# Altium schematic sheet GenesysHat - System.SchDoc
size A
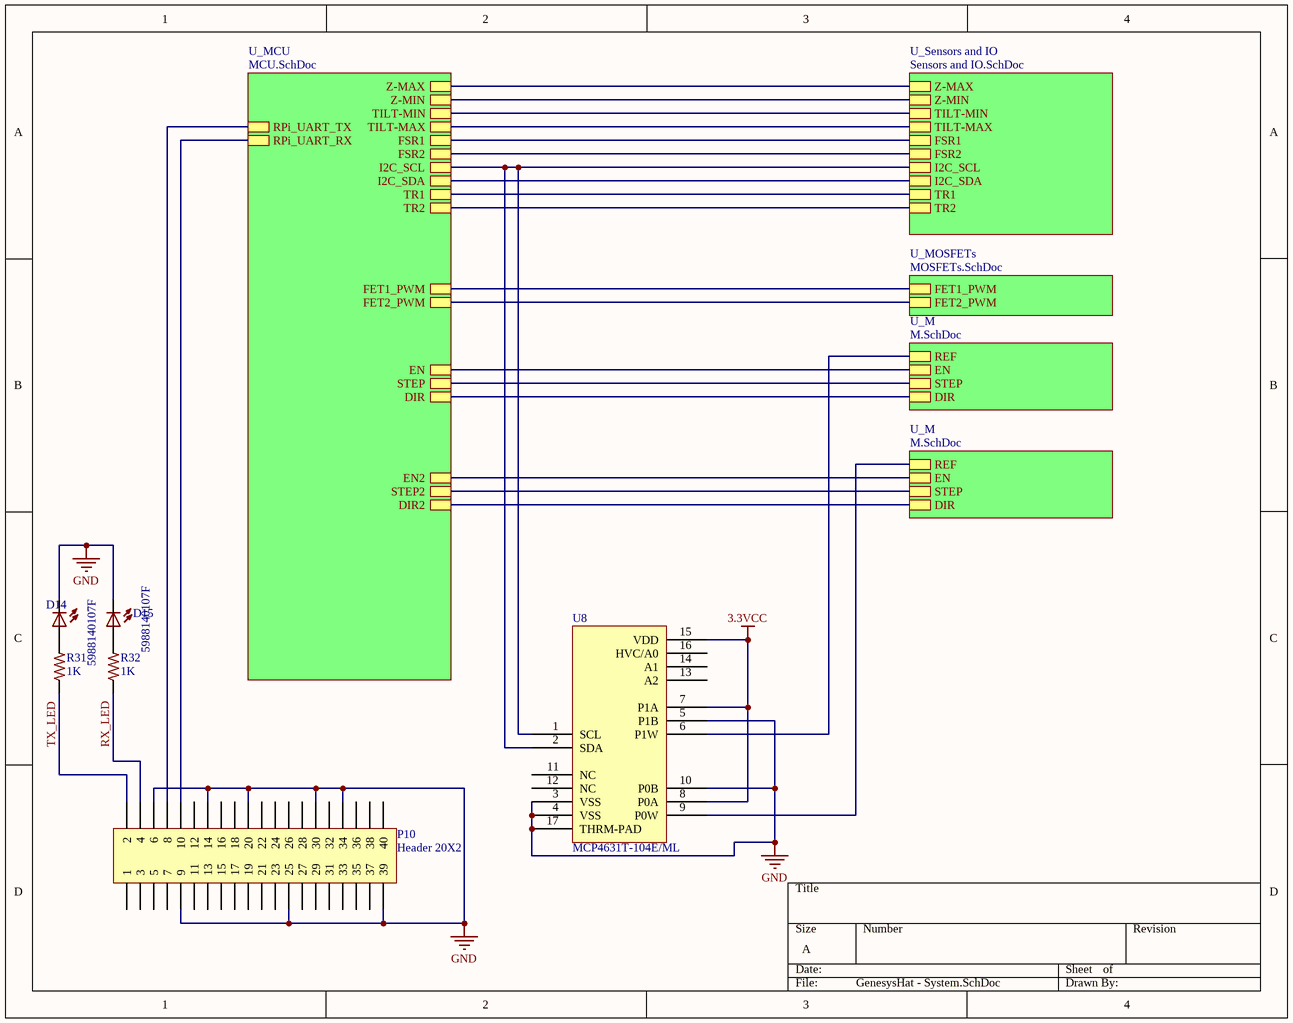
[diagram p0: GenesysHat - System.SchDoc]

## Parts
D14  5988140107F  [LED2012120]
D15  5988140107F  [LED2012120]
P10  Header 20X2  [HDR2X20]
R31  1K  [R0603]
R32  1K  [R0603]
U8  MCP4631T-104E/ML  [MCP4631T-104E/ML]

## Sub-sheets
U_M = M.SchDoc: REF, EN, STEP, DIR
U_M = M.SchDoc: REF, EN, STEP, DIR
U_MCU = MCU.SchDoc: FET1_PWM, FET2_PWM, Z-MAX, Z-MIN, TILT-MIN, TILT-MAX, FSR1, FSR2, I2C_SCL, I2C_SDA, TR1, TR2, EN, STEP, DIR, EN2, STEP2, DIR2, RPi_UART_TX, RPi_UART_RX
U_MOSFETs = MOSFETs.SchDoc: FET1_PWM, FET2_PWM
U_Sensors and IO = Sensors and IO.SchDoc: Z-MAX, Z-MIN, TILT-MIN, TILT-MAX, FSR1, FSR2, I2C_SCL, I2C_SDA, TR1, TR2

## Nets
3.3VCC: U8.7(P1A) U8.8(P0A) U8.15(VDD)
GND: D14.C D15.C P10.6 P10.9 P10.14 P10.20 P10.25 P10.30 P10.34 P10.39 U8.3(VSS) U8.4(VSS) U8.5(P1B) U8.10(P0B) U8.17(THRM-PAD)
RX_LED: P10.4 R32.1
TX_LED: P10.2 R31.1
NetD14_A: D14.A R31.2
NetD15_A: D15.A R32.2
NetP10_8: P10.8 ; sheet U_MCU/RPi_UART_TX
NetP10_10: P10.10 ; sheet U_MCU/RPi_UART_RX
NetU8_1: U8.1(SCL) U8.2(SDA) ; sheet U_Sensors and IO/I2C_SCL, sheet U_MCU/I2C_SCL
NetU8_6: U8.6(P1W) ; sheet U_M/REF
NetU8_9: U8.9(P0W) ; sheet U_M/REF
(unnamed): sheet U_M/EN, sheet U_MCU/EN
(unnamed): sheet U_M/STEP, sheet U_MCU/STEP
(unnamed): sheet U_M/DIR, sheet U_MCU/DIR
(unnamed): sheet U_MOSFETs/FET1_PWM, sheet U_MCU/FET1_PWM
(unnamed): sheet U_MOSFETs/FET2_PWM, sheet U_MCU/FET2_PWM
(unnamed): sheet U_Sensors and IO/Z-MAX, sheet U_MCU/Z-MAX
(unnamed): sheet U_Sensors and IO/Z-MIN, sheet U_MCU/Z-MIN
(unnamed): sheet U_Sensors and IO/TILT-MIN, sheet U_MCU/TILT-MIN
(unnamed): sheet U_Sensors and IO/TILT-MAX, sheet U_MCU/TILT-MAX
(unnamed): sheet U_Sensors and IO/FSR1, sheet U_MCU/FSR1
(unnamed): sheet U_Sensors and IO/FSR2, sheet U_MCU/FSR2
(unnamed): sheet U_Sensors and IO/I2C_SDA, sheet U_MCU/I2C_SDA
(unnamed): sheet U_Sensors and IO/TR1, sheet U_MCU/TR1
(unnamed): sheet U_Sensors and IO/TR2, sheet U_MCU/TR2
(unnamed): sheet U_MCU/EN2, sheet U_M/EN
(unnamed): sheet U_MCU/STEP2, sheet U_M/STEP
(unnamed): sheet U_MCU/DIR2, sheet U_M/DIR

Not connected (* = marked no-connect by the designer): P10 1 3 5 7 11 12 13 15 16 17 18 19 21 22 23 24 26 27 28 29 31 32 33 35 36 37 38 40; U8 11(NC) 12(NC) 13(A2) 14(A1) 16(HVC/A0)

## Library data of the parts
D14 D15 = 5988140107F: LED 0805 Yellow; LastRevisionNote: ImportComponents; Published: 23-Apr-2014; Publisher: UltiMachine; LastRevisionDate: 23-Apr-2014; VALUE: 5988140107F
P10 = Header 20X2: Header, 20-Pin, Dual row; LatestRevisionDate: 17-Jul-2002; LatestRevisionNote: Re-released for DXP Platform.; Publisher: Altium Limited
R31 R32 = ERJ-3EKF1001V: RES 0603 1K 100mW 1%; LastRevisionNote: ImportComponents; Published: 23-Apr-2014; Publisher: UltiMachine; LastRevisionDate: 23-Apr-2014; ManufacturerPartNumber: ERJ-3EKF1001V; VALUE: 1K
U8 = MCP4631T-104E/ML: IC DGTL POT 100K 129TAPS 16-QF; MFR: Microchip; MFR #: MCP4631T-104E/ML; Published Date: May 2015; Digikey #: MCP4631T-104E/MLCT-ND; Mounting Type: SMT QFN 16; Package: QFN 16